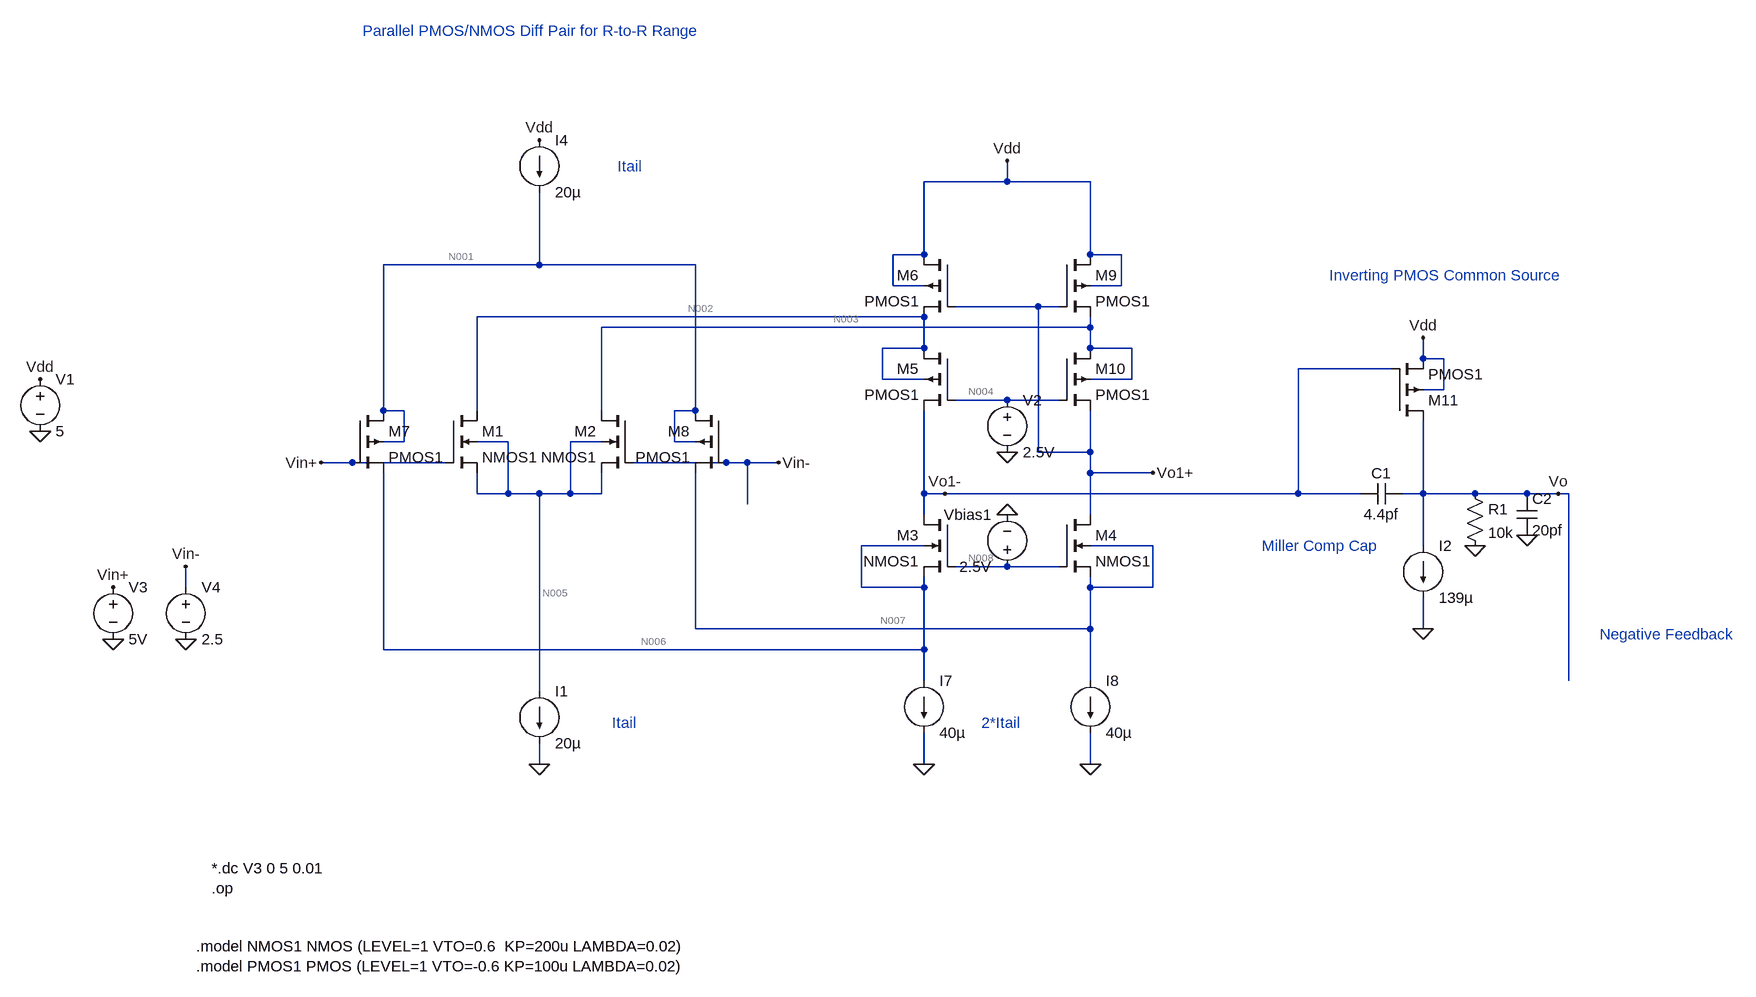
[diagram p0: schematic MOSFET_R2R_Input_Stage_CS_output.asc]
MOSFET_R2R_Input_Stage_CS_output.asc, the LTspice schematic file:
Version 4.1
SHEET 1 1760 1588
WIRE 624 224 624 192
WIRE 624 224 496 224
WIRE 752 224 624 224
WIRE 496 336 496 224
WIRE 496 336 448 336
WIRE 752 336 752 224
WIRE 800 336 752 336
WIRE -96 352 -96 240
WIRE -96 352 -336 352
WIRE 144 352 -96 352
WIRE 448 384 448 336
WIRE 496 384 448 384
WIRE 800 384 800 336
WIRE 800 384 752 384
WIRE 672 416 544 416
WIRE 704 416 672 416
WIRE 496 432 -192 432
WIRE 752 448 752 432
WIRE 752 448 0 448
WIRE 496 480 496 432
WIRE 496 480 432 480
WIRE 752 480 752 448
WIRE 816 480 752 480
WIRE 1264 496 1264 464
WIRE 1296 496 1264 496
WIRE 1216 512 1072 512
WIRE 432 528 432 480
WIRE 496 528 432 528
WIRE 816 528 816 480
WIRE 816 528 752 528
WIRE 1296 544 1296 496
WIRE 1296 544 1264 544
WIRE 624 560 544 560
WIRE 704 560 624 560
WIRE -336 576 -336 352
WIRE -304 576 -336 576
WIRE -192 576 -192 432
WIRE 0 576 0 448
WIRE 144 576 144 352
WIRE 144 576 112 576
WIRE -304 624 -304 576
WIRE -304 624 -336 624
WIRE -144 624 -192 624
WIRE 0 624 -48 624
WIRE 112 624 112 576
WIRE 144 624 112 624
WIRE 672 640 672 416
WIRE 752 640 752 576
WIRE 752 640 672 640
WIRE -384 656 -432 656
WIRE -240 656 -384 656
WIRE 192 656 48 656
WIRE 224 656 192 656
WIRE 272 656 224 656
WIRE 752 672 752 640
WIRE 848 672 752 672
WIRE -192 704 -192 672
WIRE -144 704 -144 624
WIRE -144 704 -192 704
WIRE -96 704 -144 704
WIRE -48 704 -48 624
WIRE -48 704 -96 704
WIRE 0 704 0 672
WIRE 0 704 -48 704
WIRE 496 704 496 576
WIRE 528 704 496 704
WIRE 1072 704 1072 512
WIRE 1072 704 528 704
WIRE 1168 704 1072 704
WIRE 1264 704 1264 592
WIRE 1264 704 1232 704
WIRE 1344 704 1264 704
WIRE 1424 704 1344 704
WIRE 1472 704 1424 704
WIRE 1488 704 1472 704
WIRE 224 720 224 656
WIRE 496 736 496 704
WIRE 752 736 752 672
WIRE 496 784 400 784
WIRE 848 784 752 784
WIRE 1264 784 1264 704
WIRE 624 816 544 816
WIRE 704 816 624 816
WIRE -640 848 -640 816
WIRE 400 848 400 784
WIRE 496 848 496 832
WIRE 496 848 400 848
WIRE 752 848 752 832
WIRE 848 848 848 784
WIRE 848 848 752 848
WIRE 144 912 144 672
WIRE 752 912 752 848
WIRE 752 912 144 912
WIRE 1264 912 1264 864
WIRE -336 944 -336 672
WIRE 496 944 496 848
WIRE 496 944 -336 944
WIRE 496 992 496 944
WIRE 752 992 752 912
WIRE 1488 992 1488 704
WIRE -96 1008 -96 704
WIRE -96 1120 -96 1088
WIRE 496 1120 496 1072
WIRE 752 1120 752 1072
FLAG -96 1120 0
FLAG 272 656 Vin-
FLAG -432 656 Vin+
FLAG -864 608 0
FLAG -864 528 Vdd
FLAG -96 160 Vdd
FLAG 496 1120 0
FLAG 752 1120 0
FLAG 624 192 Vdd
FLAG 624 736 0
FLAG 624 640 0
FLAG -752 928 0
FLAG -640 928 0
FLAG -752 848 Vin+
FLAG -640 816 Vin-
FLAG 1264 464 Vdd
FLAG 1472 704 Vo
FLAG 1424 768 0
FLAG 1264 912 0
FLAG 1344 784 0
FLAG 848 672 Vo1+
FLAG 528 704 Vo1-
DATAFLAG 784 672 ""
DATAFLAG 416 944 ""
DATAFLAG 656 912 ""
DATAFLAG 496 688 ""
DATAFLAG -272 352 ""
DATAFLAG -96 816 ""
DATAFLAG 1088 512 ""
DATAFLAG 1392 704 ""
SYMBOL nmos4 -240 576 R0
SYMATTR InstName M1
SYMATTR Value NMOS1
SYMBOL nmos4 48 576 M0
SYMATTR InstName M2
SYMATTR Value NMOS1
SYMBOL current -96 1008 R0
WINDOW 123 0 0 Left 0
WINDOW 39 0 0 Left 0
SYMATTR InstName I1
SYMATTR Value 20µ
SYMBOL pmos4 -384 576 R0
SYMATTR InstName M7
SYMATTR Value PMOS1
SYMBOL pmos4 192 576 M0
SYMATTR InstName M8
SYMATTR Value PMOS1
SYMBOL current -96 160 R0
WINDOW 123 0 0 Left 0
WINDOW 39 0 0 Left 0
SYMATTR InstName I4
SYMATTR Value 20µ
SYMBOL voltage -864 512 R0
WINDOW 123 0 0 Left 0
WINDOW 39 0 0 Left 0
SYMATTR InstName V1
SYMATTR Value 5
SYMBOL current 496 992 R0
WINDOW 123 0 0 Left 0
WINDOW 39 0 0 Left 0
SYMATTR InstName I7
SYMATTR Value 40µ
SYMBOL current 752 992 R0
WINDOW 123 0 0 Left 0
WINDOW 39 0 0 Left 0
SYMATTR InstName I8
SYMATTR Value 40µ
SYMBOL nmos4 544 736 M0
SYMATTR InstName M3
SYMATTR Value NMOS1
SYMBOL nmos4 704 736 R0
SYMATTR InstName M4
SYMATTR Value NMOS1
SYMBOL voltage 624 832 R180
WINDOW 0 24 96 Left 2
WINDOW 3 24 16 Left 2
WINDOW 123 0 0 Left 0
WINDOW 39 0 0 Left 0
SYMATTR InstName Vbias1
SYMATTR Value 2.5V
SYMBOL pmos4 544 480 M0
SYMATTR InstName M5
SYMATTR Value PMOS1
SYMBOL pmos4 544 336 M0
SYMATTR InstName M6
SYMATTR Value PMOS1
SYMBOL pmos4 704 336 R0
SYMATTR InstName M9
SYMATTR Value PMOS1
SYMBOL pmos4 704 480 R0
SYMATTR InstName M10
SYMATTR Value PMOS1
SYMBOL voltage 624 544 R0
WINDOW 123 0 0 Left 0
WINDOW 39 0 0 Left 0
SYMATTR InstName V2
SYMATTR Value 2.5V
SYMBOL voltage -752 832 R0
WINDOW 123 0 0 Left 0
WINDOW 39 0 0 Left 0
SYMATTR InstName V3
SYMATTR Value 5V
SYMBOL voltage -640 832 R0
WINDOW 123 0 0 Left 0
WINDOW 39 0 0 Left 0
SYMATTR InstName V4
SYMATTR Value 2.5
SYMBOL cap 1232 688 R90
WINDOW 0 0 32 VBottom 2
WINDOW 3 32 32 VTop 2
SYMATTR InstName C1
SYMATTR Value 4.4pf
SYMBOL pmos4 1216 592 M180
SYMATTR InstName M11
SYMATTR Value PMOS1
SYMATTR Value2 l=300n w=3300n
SYMBOL cap 1408 704 R0
SYMATTR InstName C2
SYMATTR Value 20pf
SYMBOL current 1264 784 R0
WINDOW 123 0 0 Left 0
WINDOW 39 0 0 Left 0
SYMATTR InstName I2
SYMATTR Value 139µ
SYMBOL res 1328 688 R0
SYMATTR InstName R1
SYMATTR Value 10k
TEXT 24 200 Left 2 ;Itail
TEXT 16 1056 Left 2 ;Itail
TEXT 584 1056 Left 2 ;2*Itail
TEXT -624 1400 Left 2 !.model NMOS1 NMOS (LEVEL=1 VTO=0.6  KP=200u LAMBDA=0.02)\n.model PMOS1 PMOS (LEVEL=1 VTO=-0.6 KP=100u LAMBDA=0.02)
TEXT -600 1280 Left 2 !*.dc V3 0 5 0.01\n.op
TEXT 1536 920 Left 2 ;Negative Feedback
TEXT 1120 368 Left 2 ;Inverting PMOS Common Source
TEXT 1016 784 Left 2 ;Miller Comp Cap
TEXT -368 -8 Left 2 ;Parallel PMOS/NMOS Diff Pair for R-to-R Range

The netlist it stands for:
* MOSFET_R2R_Input_Stage_CS_output.asc
M1 N002 Vin+ N005 N005 NMOS1
M2 N003 Vin- N005 N005 NMOS1
I1 N005 0 20µ
M7 N001 Vin+ N006 N001 PMOS1
M8 N001 Vin- N007 N001 PMOS1
I4 Vdd N001 20µ
V1 Vdd 0 5
I7 N006 0 40µ
I8 N007 0 40µ
M3 Vo1- N008 N006 N006 NMOS1
M4 Vo1+ N008 N007 N007 NMOS1
Vbias1 N008 0 2.5V
M5 N002 N004 Vo1- N002 PMOS1
M6 Vdd Vo1+ N002 Vdd PMOS1
M9 Vdd Vo1+ N003 Vdd PMOS1
M10 N003 N004 Vo1+ N003 PMOS1
V2 N004 0 2.5V
V3 Vin+ 0 5V
V4 Vin- 0 2.5
C1 Vo Vo1- 4.4pf
M11 Vo Vo1- Vdd Vdd PMOS1 l=300n w=3300n
C2 Vo 0 20pf
I2 Vo 0 139µ
R1 Vo 0 10k
.model NMOS NMOS
.model PMOS PMOS
.lib standard.mos
* Itail
* Itail
* 2*Itail
.model NMOS1 NMOS (LEVEL=1 VTO=0.6  KP=200u LAMBDA=0.02)
.model PMOS1 PMOS (LEVEL=1 VTO=-0.6 KP=100u LAMBDA=0.02)
*.dc V3 0 5 0.01
.op
* Negative Feedback
* Inverting PMOS Common Source
* Miller Comp Cap
* Parallel PMOS/NMOS Diff Pair for R-to-R Range
.backanno
.end

* Results of the author's LTspice run, read from the files saved beside the schematic
* Operating Point:
*   V(n001) = 3.193 V
*   V(n002) = 3.1 V
*   V(n003) = 4.079 V
*   V(n004) = 2.5 V
*   V(n005) = 3.026 V
*   V(n006) = -9.773 MV
*   V(n007) = 1.285 V
*   V(n008) = 2.5 V
*   V(vdd) = 5 V
*   V(vin+) = 5 V
*   V(vin-) = 2.5 V
*   V(vo) = 5 V
*   V(vo1+) = 3.519 V
*   V(vo1-) = -9.773 MV
*   I(C1) = 0 A
*   I(C2) = 0 A
*   I(I1) = 20 µA
*   I(I2) = 139 µA
*   I(I4) = 20 µA
*   I(I7) = 40 µA
*   I(I8) = 40 µA
*   I(R1) = 500 µA
*   I(V1) = -738.9 µA
*   I(V2) = 0 A
*   I(V3) = 0 A
*   I(V4) = 0 A
*   I(Vbias1) = 0 A
*   Ib(M1) = -84.12 fA
*   Ib(M10) = 569.8 fA
*   Ib(M11) = 0 A
*   Ib(M2) = -1.063 pA
*   Ib(M3) = 0 A
*   Ib(M4) = -2.244 pA
*   Ib(M5) = 9.773 µA
*   Ib(M6) = 1.91 pA
*   Ib(M7) = 9.773 µA
*   Ib(M8) = 1.919 pA
*   Ib(M9) = 931.5 fA
*   Id(M1) = 20 µA
*   Id(M10) = 39.55 µA
*   Id(M11) = -640.8 µA
*   Id(M2) = 2.116 pA
*   Id(M3) = 21.85 µA
*   Id(M4) = 39.55 µA
*   Id(M5) = 10.53 µA
*   Id(M6) = 40.31 µA
*   Id(M7) = 9.773 µA
*   Id(M8) = 453.1 nA
*   Id(M9) = 39.55 µA
*   Ig(M1) = 0 A
*   Ig(M10) = 0 A
*   Ig(M11) = 0 A
*   Ig(M2) = 0 A
*   Ig(M3) = 0 A
*   Ig(M4) = 0 A
*   Ig(M5) = 0 A
*   Ig(M6) = 0 A
*   Ig(M7) = 0 A
*   Ig(M8) = 0 A
*   Ig(M9) = 0 A
*   Is(M1) = -20 µA
*   Is(M10) = -39.55 µA
*   Is(M11) = 640.8 µA
*   Is(M2) = -1.053 pA
*   Is(M3) = -21.85 µA
*   Is(M4) = -39.55 µA
*   Is(M5) = -20.31 µA
*   Is(M6) = -40.31 µA
*   Is(M7) = -19.55 µA
*   Is(M8) = -453.1 nA
*   Is(M9) = -39.55 µA